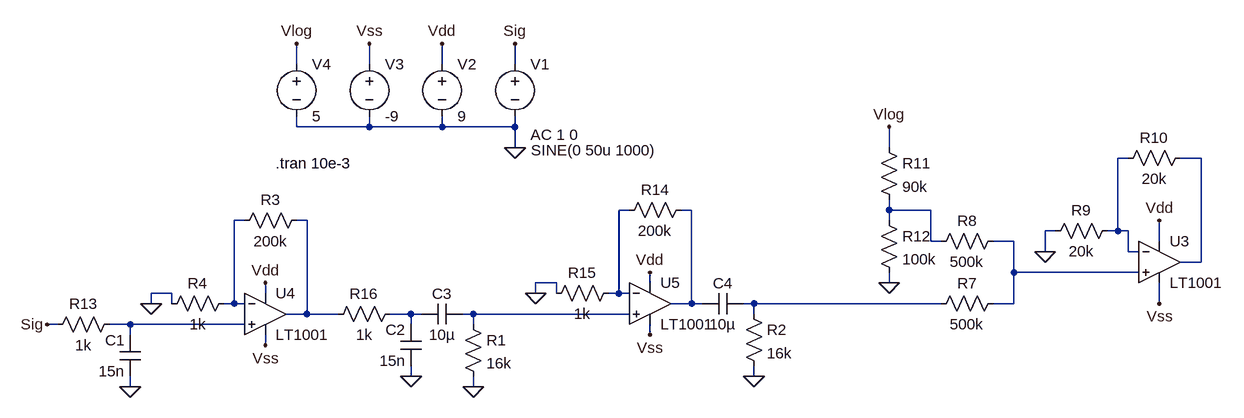
[diagram p0: schematic HB100_Signal_Conditioner.asc]
HB100_Signal_Conditioner.asc, the LTspice schematic file:
Version 4
SHEET 1 2008 680
WIRE 576 128 576 96
WIRE 688 128 688 96
WIRE 800 128 800 96
WIRE 912 128 912 96
WIRE 576 224 576 208
WIRE 688 224 688 208
WIRE 688 224 576 224
WIRE 800 224 800 208
WIRE 800 224 688 224
WIRE 912 224 912 208
WIRE 912 224 800 224
WIRE 912 256 912 224
WIRE 1488 256 1488 224
WIRE 1856 272 1840 272
WIRE 1968 272 1936 272
WIRE 1088 352 1072 352
WIRE 1184 352 1168 352
WIRE 1488 352 1488 336
WIRE 1552 352 1488 352
WIRE 496 368 480 368
WIRE 592 368 576 368
WIRE 1488 368 1488 352
WIRE 1744 384 1728 384
WIRE 1840 384 1840 272
WIRE 1840 384 1824 384
WIRE 1856 384 1840 384
WIRE 1552 400 1552 352
WIRE 1568 400 1552 400
WIRE 1680 400 1648 400
WIRE 1904 400 1904 368
WIRE 1728 416 1728 384
WIRE 1856 416 1856 384
WIRE 1872 416 1856 416
WIRE 1968 432 1968 272
WIRE 1968 432 1936 432
WIRE 1680 448 1680 400
WIRE 1872 448 1680 448
WIRE 976 464 944 464
WIRE 1120 464 1120 448
WIRE 1488 464 1488 448
WIRE 384 480 352 480
WIRE 528 480 528 464
WIRE 944 480 944 464
WIRE 976 480 976 464
WIRE 1072 480 1072 352
WIRE 1072 480 1056 480
WIRE 1088 480 1072 480
WIRE 352 496 352 480
WIRE 384 496 384 480
WIRE 480 496 480 368
WIRE 480 496 464 496
WIRE 496 496 480 496
WIRE 1184 496 1184 352
WIRE 1184 496 1152 496
WIRE 1200 496 1184 496
WIRE 1280 496 1264 496
WIRE 1568 496 1280 496
WIRE 1680 496 1680 448
WIRE 1680 496 1648 496
WIRE 1904 496 1904 464
WIRE 592 512 592 368
WIRE 592 512 560 512
WIRE 640 512 592 512
WIRE 752 512 720 512
WIRE 768 512 752 512
WIRE 848 512 832 512
WIRE 1088 512 848 512
WIRE 1280 512 1280 496
WIRE 208 528 192 528
WIRE 320 528 288 528
WIRE 496 528 320 528
WIRE 752 528 752 512
WIRE 848 528 848 512
WIRE 320 544 320 528
WIRE 1120 544 1120 528
WIRE 528 560 528 544
WIRE 752 608 752 592
WIRE 1280 608 1280 592
WIRE 320 624 320 608
WIRE 848 624 848 608
FLAG 912 256 0
FLAG 800 96 Vdd
FLAG 688 96 Vss
FLAG 576 96 Vlog
FLAG 1728 416 0
FLAG 1904 368 Vdd
FLAG 1904 496 Vss
FLAG 1488 464 0
FLAG 1488 224 Vlog
FLAG 528 464 Vdd
FLAG 528 560 Vss
FLAG 352 496 0
FLAG 912 96 Sig
FLAG 320 624 0
FLAG 1120 448 Vdd
FLAG 1120 544 Vss
FLAG 944 480 0
FLAG 752 608 0
FLAG 192 528 Sig
FLAG 848 624 0
FLAG 1280 608 0
SYMBOL voltage 912 112 R0
WINDOW 3 25 148 Left 2
WINDOW 123 24 124 Left 2
WINDOW 39 0 0 Left 0
SYMATTR Value SINE(0 50u 1000)
SYMATTR Value2 AC 1 0
SYMATTR InstName V1
SYMBOL voltage 800 112 R0
WINDOW 123 0 0 Left 0
WINDOW 39 0 0 Left 0
SYMATTR InstName V2
SYMATTR Value 9
SYMBOL voltage 688 112 R0
WINDOW 123 0 0 Left 0
WINDOW 39 0 0 Left 0
SYMATTR InstName V3
SYMATTR Value -9
SYMBOL voltage 576 112 R0
WINDOW 123 0 0 Left 0
WINDOW 39 0 0 Left 0
SYMATTR InstName V4
SYMATTR Value 5
SYMBOL res 1664 480 R90
WINDOW 0 0 56 VBottom 2
WINDOW 3 32 56 VTop 2
SYMATTR InstName R7
SYMATTR Value 500k
SYMBOL res 1664 384 R90
WINDOW 0 0 56 VBottom 2
WINDOW 3 32 56 VTop 2
SYMATTR InstName R8
SYMATTR Value 500k
SYMBOL Opamps\\LT1001 1904 368 R0
SYMATTR InstName U3
SYMBOL res 1840 368 R90
WINDOW 0 0 56 VBottom 2
WINDOW 3 32 56 VTop 2
SYMATTR InstName R9
SYMATTR Value 20k
SYMBOL res 1952 256 R90
WINDOW 0 0 56 VBottom 2
WINDOW 3 32 56 VTop 2
SYMATTR InstName R10
SYMATTR Value 20k
SYMBOL res 1472 240 R0
SYMATTR InstName R11
SYMATTR Value 90k
SYMBOL res 1472 352 R0
SYMATTR InstName R12
SYMATTR Value 100k
SYMBOL Opamps\\LT1001 528 448 R0
SYMATTR InstName U4
SYMBOL res 592 352 R90
WINDOW 0 0 56 VBottom 2
WINDOW 3 32 56 VTop 2
SYMATTR InstName R3
SYMATTR Value 200k
SYMBOL res 480 480 R90
WINDOW 0 0 56 VBottom 2
WINDOW 3 32 56 VTop 2
SYMATTR InstName R4
SYMATTR Value 1k
SYMBOL cap 336 608 R180
WINDOW 0 24 56 Left 2
WINDOW 3 24 8 Left 2
SYMATTR InstName C1
SYMATTR Value 15n
SYMBOL res 304 512 R90
WINDOW 0 0 56 VBottom 2
WINDOW 3 32 56 VTop 2
SYMATTR InstName R13
SYMATTR Value 1k
SYMBOL Opamps\\LT1001 1120 432 R0
SYMATTR InstName U5
SYMBOL res 1184 336 R90
WINDOW 0 0 56 VBottom 2
WINDOW 3 32 56 VTop 2
SYMATTR InstName R14
SYMATTR Value 200k
SYMBOL res 1072 464 R90
WINDOW 0 0 56 VBottom 2
WINDOW 3 32 56 VTop 2
SYMATTR InstName R15
SYMATTR Value 1k
SYMBOL cap 768 592 R180
WINDOW 0 24 56 Left 2
WINDOW 3 24 8 Left 2
SYMATTR InstName C2
SYMATTR Value 15n
SYMBOL res 736 496 R90
WINDOW 0 0 56 VBottom 2
WINDOW 3 32 56 VTop 2
SYMATTR InstName R16
SYMATTR Value 1k
SYMBOL cap 832 496 R90
WINDOW 0 0 32 VBottom 2
WINDOW 3 32 32 VTop 2
SYMATTR InstName C3
SYMATTR Value 10µ
SYMBOL res 832 512 R0
SYMATTR InstName R1
SYMATTR Value 16k
SYMBOL cap 1264 480 R90
WINDOW 0 0 32 VBottom 2
WINDOW 3 32 32 VTop 2
SYMATTR InstName C4
SYMATTR Value 10µ
SYMBOL res 1264 496 R0
SYMATTR InstName R2
SYMATTR Value 16k
TEXT 544 280 Left 2 !.tran 10e-3

The netlist it stands for:
* HB100_Signal_Conditioner.asc
V1 Sig 0 SINE(0 50u 1000) AC 1 0
V2 Vdd 0 9
V3 Vss 0 -9
V4 Vlog 0 5
R7 N008 N009 500k
R8 N008 N005 500k
XU3 N008 N001 Vdd Vss N002 LT1001  ; pins In+ In- V+ V- OUT
R9 N001 0 20k
R10 N002 N001 20k
R11 Vlog N005 90k
R12 N005 0 100k
XU4 N012 N006 Vdd Vss N007 LT1001  ; pins In+ In- V+ V- OUT
R3 N007 N006 200k
R4 N006 0 1k
C1 0 N012 15n
R13 N012 Sig 1k
XU5 N011 N003 Vdd Vss N004 LT1001  ; pins In+ In- V+ V- OUT
R14 N004 N003 200k
R15 N003 0 1k
C2 0 N010 15n
R16 N010 N007 1k
C3 N011 N010 10µ
R1 N011 0 16k
C4 N009 N004 10µ
R2 N009 0 16k
.tran 10e-3
.lib LTC.lib
.backanno
.end